# Altium schematic sheet mcu.SchDoc
size A4
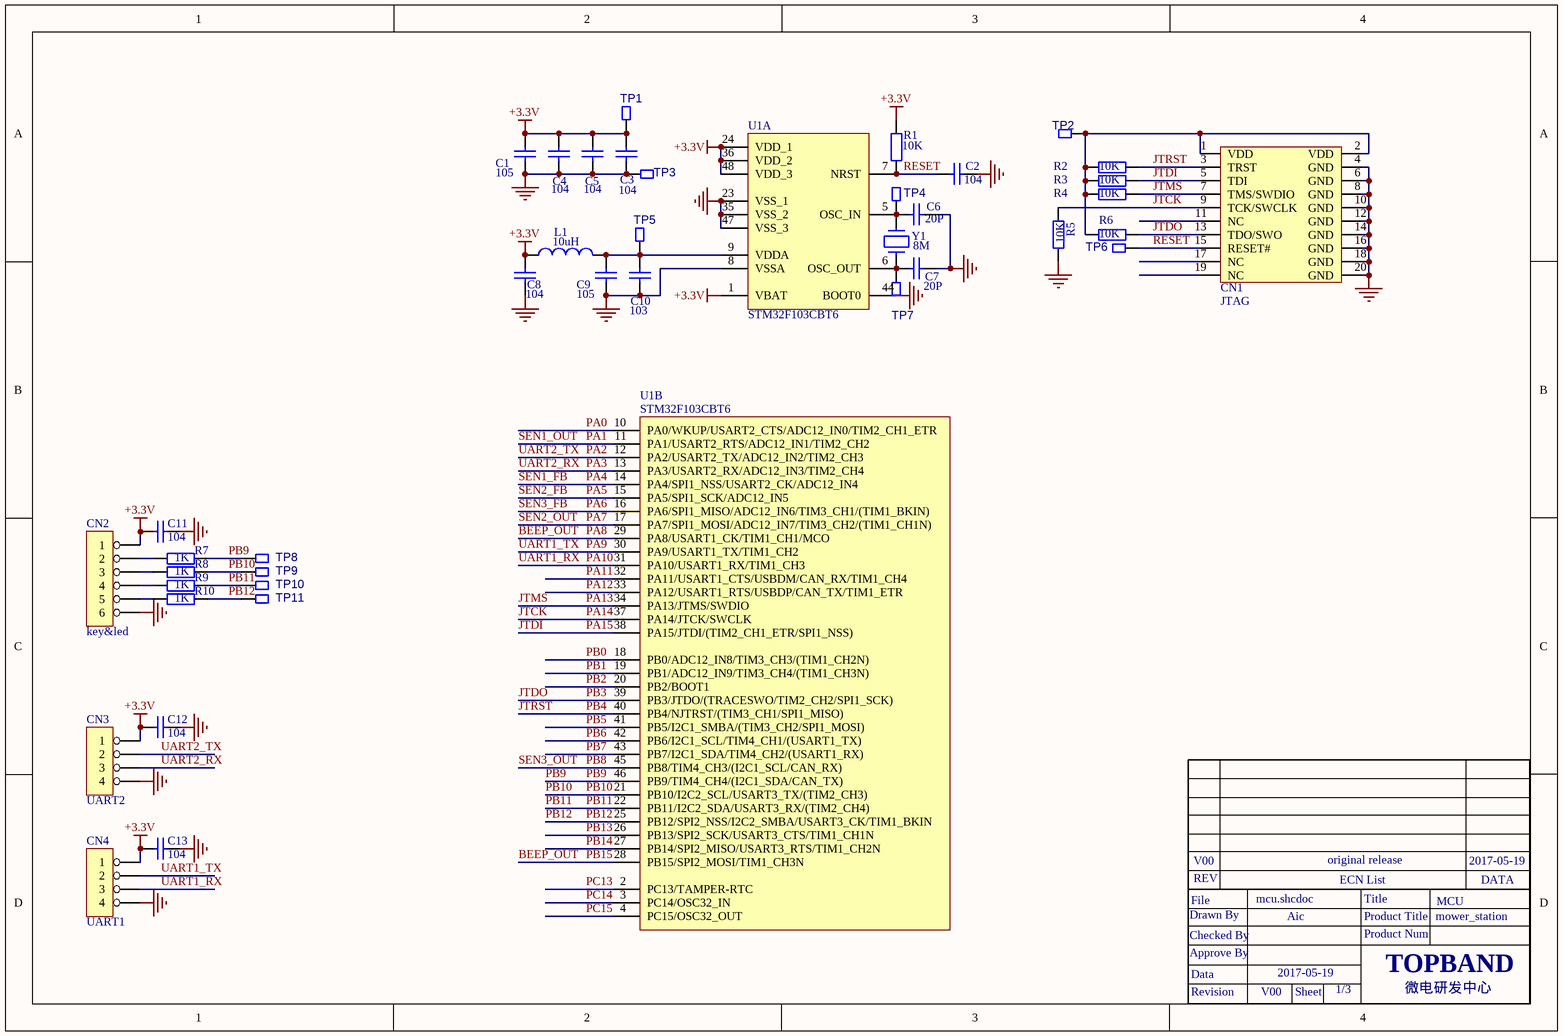
[diagram p0: mcu.SchDoc]

## Parts
C1  105  [0603C]
C2  104  [0603C]
C3  104  [0603C]
C4  104  [0603C]
C5  104  [0603C]
C6  20P  [0603C]
C7  20P  [0603C]
C8  104  [0603C]
C9  105  [0603C]
C10  103  [0603C]
C11  104  [0603C]
C12  104  [0603C]
C13  104  [0603C]
CN1  JTAG  [JTAG_20]
CN2  key&led  [CON6-2.54]
CN3  UART2  [CON4-2.54]
CN4  UART1  [CON4-2.54]
L1  10uH  [0805L-BOT]
R1  10K  [0603R]
R2  10K  [0603R]
R3  10K  [0603R]
R4  10K  [0603R]
R5  10K  [0603R]
R6  10K  [0603R]
R7  1K  [0603R]
R8  1K  [0603R]
R9  1K  [0603R]
R10  1K  [0603R]
TP1  TP  [TEST-0.8MM]  (value not drawn)
TP2  TP  [TEST-0.8MM]  (value not drawn)
TP3  TP  [TEST-0.8MM]  (value not drawn)
TP4  TP  [TEST-0.8MM]  (value not drawn)
TP5  TP  [TEST-0.8MM]  (value not drawn)
TP6  TP  [TEST-0.8MM]  (value not drawn)
TP7  TP  [TEST-0.8MM]  (value not drawn)
TP8  TP  [TEST-0.8MM]  (value not drawn)
TP9  TP  [TEST-0.8MM]  (value not drawn)
TP10  TP  [TEST-0.8MM]  (value not drawn)
TP11  TP  [TEST-0.8MM]  (value not drawn)
U1  STM32F103CBT6  [LQFP48]  (parts A,B of 2)
Y1  8M  [XTAL-J]

## Nets
+3.3V: C1.1 C3.1 C4.1 C5.1 C8.1 C11.1 C12.1 C13.1 CN2.1 CN3.1 CN4.1 L1.1 R1.1 TP1.1 U1.1(VBAT) U1.24(VDD_1) U1.36(VDD_2) U1.48(VDD_3)
GND: C1.2 C2.1 C3.2 C4.2 C5.2 C6.1 C7.1 C8.2 C9.2 C10.2 C11.2 C12.2 C13.2 CN1.4(GND) CN1.6(GND) CN1.8(GND) CN1.10(GND) CN1.12(GND) CN1.14(GND) CN1.16(GND) CN1.18(GND) CN1.20(GND) CN2.6 CN3.4 CN4.4 R5.2 TP3.1 U1.8(VSSA) U1.23(VSS_1) U1.35(VSS_2) U1.44(BOOT0) U1.47(VSS_3)
BEEP_OUT: U1.28(PB15/SPI2_MOSI/TIM1_CH3N) U1.29(PA8/USART1_CK/TIM1_CH1/MCO)  [also labelled PA8, PB15]
JTCK: CN1.9(TCK/SWCLK) R5.1 U1.37(PA14/JTCK/SWCLK)  [also labelled PA14]
JTDI: CN1.5(TDI) R3.1 U1.38(PA15/JTDI/(TIM2_CH1_ETR/SPI1_NSS))  [also labelled PA15]
JTDO: CN1.13(TDO/SWO) R6.1 U1.39(PB3/JTDO/(TRACESWO/TIM2_CH2/SPI1_SCK))  [also labelled PB3]
JTMS: CN1.7(TMS/SWDIO) R4.1 U1.34(PA13/JTMS/SWDIO)  [also labelled PA13]
JTRST: CN1.3(TRST) R2.1 U1.40(PB4/NJTRST/(TIM3_CH1/SPI1_MISO))  [also labelled PB4]
PA0: U1.10(PA0/WKUP/USART2_CTS/ADC12_IN0/TIM2_CH1_ETR)
PA1: U1.11(PA1/USART2_RTS/ADC12_IN1/TIM2_CH2)  [also labelled SEN1_OUT]
PA2: CN3.2 U1.12(PA2/USART2_TX/ADC12_IN2/TIM2_CH3)  [also labelled UART2_TX]
PA3: CN3.3 U1.13(PA3/USART2_RX/ADC12_IN3/TIM2_CH4)  [also labelled UART2_RX]
PA4: U1.14(PA4/SPI1_NSS/USART2_CK/ADC12_IN4)  [also labelled SEN1_FB]
PA5: U1.15(PA5/SPI1_SCK/ADC12_IN5)  [also labelled SEN2_FB]
PA6: U1.16(PA6/SPI1_MISO/ADC12_IN6/TIM3_CH1/(TIM1_BKIN))  [also labelled SEN3_FB]
PA7: U1.17(PA7/SPI1_MOSI/ADC12_IN7/TIM3_CH2/(TIM1_CH1N))  [also labelled SEN2_OUT]
PA9: CN4.2 U1.30(PA9/USART1_TX/TIM1_CH2)  [also labelled UART1_TX]
PA10: CN4.3 U1.31(PA10/USART1_RX/TIM1_CH3)  [also labelled UART1_RX]
PA11: U1.32(PA11/USART1_CTS/USBDM/CAN_RX/TIM1_CH4)
PA12: U1.33(PA12/USART1_RTS/USBDP/CAN_TX/TIM1_ETR)
PB0: U1.18(PB0/ADC12_IN8/TIM3_CH3/(TIM1_CH2N))
PB1: U1.19(PB1/ADC12_IN9/TIM3_CH4/(TIM1_CH3N))
PB2: U1.20(PB2/BOOT1)
PB5: U1.41(PB5/I2C1_SMBA/(TIM3_CH2/SPI1_MOSI))
PB6: U1.42(PB6/I2C1_SCL/TIM4_CH1/(USART1_TX))
PB7: U1.43(PB7/I2C1_SDA/TIM4_CH2/(USART1_RX))
PB8: U1.45(PB8/TIM4_CH3/(I2C1_SCL/CAN_RX))  [also labelled SEN3_OUT]
PB9: R7.2 TP8.1 U1.46(PB9/TIM4_CH4/(I2C1_SDA/CAN_TX))
PB10: R8.2 TP9.1 U1.21(PB10/I2C2_SCL/USART3_TX/(TIM2_CH3))
PB11: R9.2 TP10.1 U1.22(PB11/I2C2_SDA/USART3_RX/(TIM2_CH4))
PB12: R10.2 TP11.1 U1.25(PB12/SPI2_NSS/I2C2_SMBA/USART3_CK/TIM1_BKIN)
PB13: U1.26(PB13/SPI2_SCK/USART3_CTS/TIM1_CH1N)
PB14: U1.27(PB14/SPI2_MISO/USART3_RTS/TIM1_CH2N)
PC13: U1.2(PC13/TAMPER-RTC)
PC14: U1.3(PC14/OSC32_IN)
PC15: U1.4(PC15/OSC32_OUT)
RESET: C2.2 CN1.15(RESET#) R1.2 TP6.1 U1.7(NRST)
NetC6_2: C6.2 TP4.1 U1.5(OSC_IN) Y1.2
NetC7_2: C7.2 TP7.1 U1.6(OSC_OUT) Y1.1
NetC9_1: C9.1 C10.1 L1.2 TP5.1 U1.9(VDDA)
NetCN1_1: CN1.1(VDD) CN1.2(VDD) R2.2 R3.2 R4.2 R6.2 TP2.1
NetCN2_2: CN2.2 R7.1
NetCN2_3: CN2.3 R8.1
NetCN2_4: CN2.4 R9.1
NetCN2_5: CN2.5 R10.1

Not connected (* = marked no-connect by the designer): CN1 11(NC) 17(NC) 19(NC)

## Notes on the sheet
- Drawn By
- File
- REV
- V00
- mcu.shcdoc
- Aic
- original release
- ECN List
- Product Title
- Title
- mower_station
- MCU
- 2017-05-19
- DATA
- Approve By
- Checked By
- Data
- Product Num
- TOPBAND
- Revision
- Sheet
- 1/3
- 微电研发中心

## Library data of the parts
C1-C13 = Cap(0603): Component Kind: standard; Component Type: standard
CN2 = 6Pin: 插座; U_TABLE: U_SAM01021601; id: 34; Part Number: 6Pin; Component Kind: Standard; Component Type: Standard; Designator: 6Pin; Pin Count: 6
CN3 CN4 = 4Pin(2~3.96mm): 插座; U_TABLE: U_SAM01021601; id: 28; Part Number: 4Pin(2~3.96mm); Component Kind: Standard; Component Type: Standard; Designator: 4Pin(2~3.96mm); Footprint: CON4-2.0; Pin Count: 4
L1 = Inductor(0805): 电感; U_TABLE: U_SAM010207; id: 140; Part Number: Inductor(0805); Component Kind: standard; Component Type: standard
R1-R6 = Res2: Resistor; Value: 1K; 物料编码: 150103083; Published: 8-Jun-2000; LatestRevisionDate: 17-Jul-2002; LatestRevisionNote: Re-released for DXP Platform.; PackageReference: AXIAL-0.4; Publisher: Altium Limited
R7-R10 = Res(0603): 120100221; U_TABLE: U_SAM010201; id: 106; Description: 电阻器; U_ITEM_ID（物料编码）: 120101813; U_100114（SAP物料描述）: SMT电阻RR0603_1502_F_1/16W_50V_国巨_; U_100012（标称值-文本）: 1502; U_100116（标称值-浮点）: 15; U_100013（单位）: KΩ; U_100083（允许偏差）: F; U_100029（额定功率）: 1/16W; U_100040（封装方式）: RR0603; U_100049（极限电压）: 50V; U_100047（环保属性）: 环保; U_100107（工厂BOM使用频率）: 2000:8;; U_100105（工厂库存）: 1200:0.000;2000:3965.000;3000:0.000;; U_100117（工厂采购量）: 2000:5000.000;; Part Number: Res(0603); Component Kind: standard; Component Type: standard; U_100086（指定供应商）: 国巨
U1 = STM32F103x8
Y1 = XTAL-J: 晶振; U_TABLE: U_SAM010212; id: 101; Part Number: XTAL-J; Component Kind: standard; Component Type: standard; Pin Count: 2